# Altium project DCDC_4812.PrjPcb
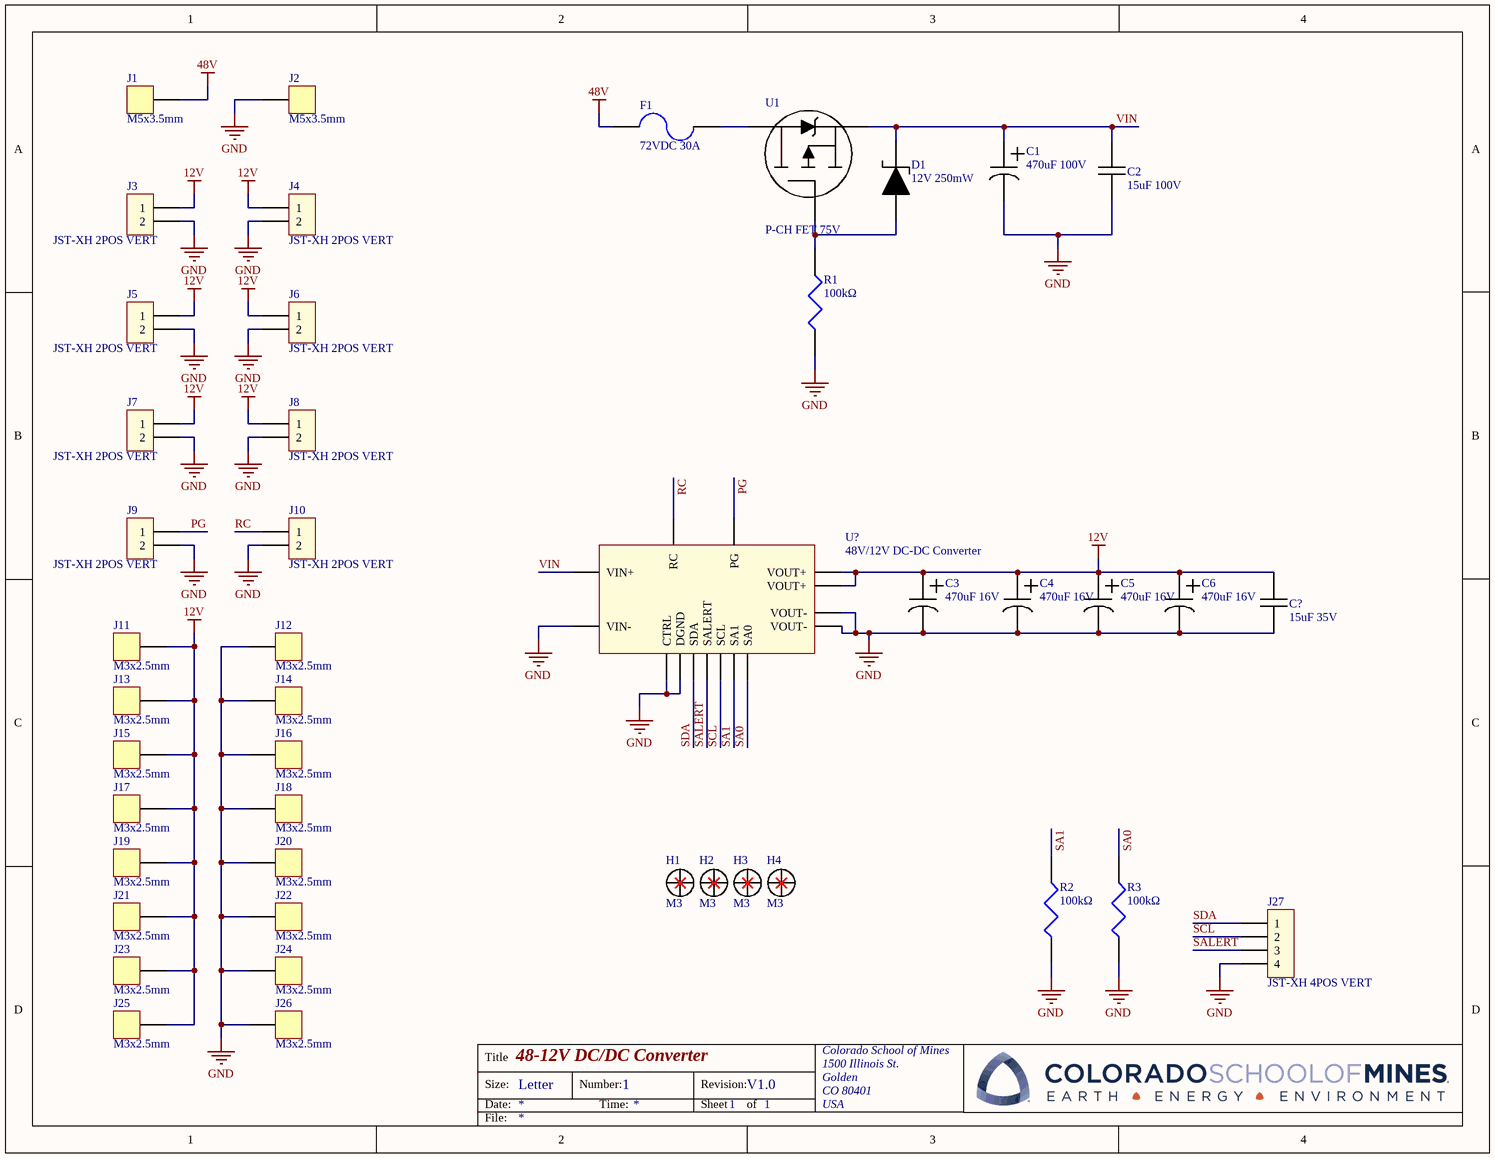
[diagram p0: DCDC_4812.SchDoc]
1 sheet, 45 parts. Net scope: global (net labels, ports and power ports of the same name join across sheets).
Board file: DCDC_4812.PcbDoc

## Sheet DCDC_4812.SchDoc: 48-12V DC/DC Converter
size Letter; Organization: Colorado School of Mines; Address1: 1500 Illinois St.; Address2: Golden; Address3: CO 80401; Address4: USA; DocumentNumber: 1; Revision: V1.0; SheetNumber: 1; SheetTotal: 1

### Parts
C1  470uF 100V  [MAL2150_CASE1821]
C2  15uF 100V  [C2220M Generic]
C3  470uF 16V  [875115357006]
C4  470uF 16V  [875115357006]
C5  470uF 16V  [875115357006]
C6  470uF 16V  [875115357006]
C7  15uF 35V  [C2012M Generic]
D1  12V 250mW  [BZX84-C12,235]
F1  72VDC 30A  [0456030.ER]
H1  M3  [M3_MOUNTING_HOLE]
H2  M3  [M3_MOUNTING_HOLE]
H3  M3  [M3_MOUNTING_HOLE]
H4  M3  [M3_MOUNTING_HOLE]
J1  M5x3.5mm  [74655095]
J2  M5x3.5mm  [74655095]
J3  JST-XH 2POS VERT  [FP-B2B-XH-A_LF_SN-MFG]
J4  JST-XH 2POS VERT  [FP-B2B-XH-A_LF_SN-MFG]
J5  JST-XH 2POS VERT  [FP-B2B-XH-A_LF_SN-MFG]
J6  JST-XH 2POS VERT  [FP-B2B-XH-A_LF_SN-MFG]
J7  JST-XH 2POS VERT  [FP-B2B-XH-A_LF_SN-MFG]
J8  JST-XH 2POS VERT  [FP-B2B-XH-A_LF_SN-MFG]
J9  JST-XH 2POS VERT  [FP-B2B-XH-A_LF_SN-MFG]
J10  JST-XH 2POS VERT  [FP-B2B-XH-A_LF_SN-MFG]
J11  M3x2.5mm  [74650073]
J12  M3x2.5mm  [74650073]
J13  M3x2.5mm  [74650073]
J14  M3x2.5mm  [74650073]
J15  M3x2.5mm  [74650073]
J16  M3x2.5mm  [74650073]
J17  M3x2.5mm  [74650073]
J18  M3x2.5mm  [74650073]
J19  M3x2.5mm  [74650073]
J20  M3x2.5mm  [74650073]
J21  M3x2.5mm  [74650073]
J22  M3x2.5mm  [74650073]
J23  M3x2.5mm  [74650073]
J24  M3x2.5mm  [74650073]
J25  M3x2.5mm  [74650073]
J26  M3x2.5mm  [74650073]
J27  JST-XH 4POS VERT  [JST_B4B-XH-A_LF_SN_0]
R1  100kΩ  [RMCF0805]
R2  100kΩ  [RMCF0805]
R3  100kΩ  [RMCF0805]
U1  P-CH FET 75V  [SMP3003-DL-1E]
U2  48V/12V DC-DC Converter  [BMR4800102/002]

### Nets
12V: C3.1 C4.1 C5.1 C6.1 C7.2 J3.1 J4.1 J5.1 J6.1 J7.1 J8.1 J11.1 J13.1 J15.1 J17.1 J19.1 J21.1 J23.1 J25.1 U2.7(VOUT+) U2.8(VOUT+)
48V: F1.1 J1.1
GND: C1.2 C2.2 C3.2 C4.2 C5.2 C6.2 C7.1 J2.1 J3.2 J4.2 J5.2 J6.2 J7.2 J8.2 J9.2 J10.2 J12.1 J14.1 J16.1 J18.1 J20.1 J22.1 J24.1 J26.1 J27.4 R1.1 R2.1 R3.1 U2.3(VIN-) U2.4(VOUT-) U2.5(VOUT-) U2.9(CTRL) U2.10(DGND)
PG: J9.1 U2.6(PG)
RC: J10.1 U2.2(RC)
SA0: R3.2 U2.15(SA0)
SA1: R2.2 U2.14(SA1)
SALERT: J27.3 U2.12(SALERT)
SCL: J27.2 U2.13(SCL)
SDA: J27.1 U2.11(SDA)
VIN: C1.1 C2.1 D1.3 U1.3 U2.1(VIN+)
NetD1_1: D1.1 R1.2 U1.1
NetF1_2: F1.2 U1.4

Not connected (* = marked no-connect by the designer): H1 1*; H2 1*; H3 1*; H4 1*

### Notes on the sheet
- Title
- Size:
- Date:
- Letter
- Number:
- Time:
- Revision:
- Sheet
- of
- File:

### Library data of the parts
C1 = MAL215099913E3: Vishay CAP ALUM 470UF 20% 100V SMD; Part Number: MAL215099913E3; Manufacturer: Vishay; Value: 470uF 100V; ComponentLink1Description: DigiKey; ComponentLink1URL: https://www.digikey.com/en/products/detail/vishay-beyschlag-draloric-bc-components/MAL215099913E3/5414592
C2 = C5750X7S2A156M250KB: TDK CAP CER 15UF 100V X7S 2220; Manufacturer: TDK Corporation; ComponentLink1Description: DigiKey; ComponentLink1URL: https://www.digikey.com/en/products/detail/tdk-corporation/C5750X7S2A156M250KB/2443522; Part Number: C5750X7S2A156M250KB; Value: 15uF 100V
C3-C6 = 875115357006: Wurth CAP ALUM POLY 470UF 20% 16V SMD; Manufacturer: Würth Elektronik; ComponentLink1Description: DigiKey; ComponentLink1URL: https://www.digikey.com/en/products/detail/w%C3%BCrth-elektronik/875115357006/5147625?s=N4IgTCBcDaIBwHYCsBGFSDMSEAYcDYQBdAXyA; Part Number: CAP ALUM POLY 470UF 20% 16V SMD; Value: 470uF 16V
C7 = C2012X5R1V156M125AC: TDK CAP CER 15UF 35V X5R 0805; Manufacturer: TDK Corporation; Part Number: C2012X5R1V156M125AC; Value: 15uF 35V; ComponentLink1Description: New link; ComponentLink1URL: *
D1 = BZX84-C12,235: Nexperia DIODE ZENER 12V 250MW TO236AB; ComponentLink1Description: DigiKey; ComponentLink1URL: https://www.digikey.com/en/products/detail/nexperia-usa-inc/BZX84-C12-235/5221767; Part Number: BZX84-C12,235; Manufacturer: Nexperia; Value: 12V 250mW
F1 = 0456030.ER: Littelfuse FUSE BOARD MNT 30A 125VAC 72VDC; Manufacturer: Littelfuse; Part Number: 0456030.ER; Value: 72VDC 30A; ComponentLink1Description: DigiKey; ComponentLink1URL: https://www.digikey.com/en/products/detail/littelfuse-inc/0456030-ER/1754635
H1-H4 = M3_Mounting_Hole: MECHANICAL M3 Mounting Hole
J1 J2 = 74655095R: Wurth WP-THRBU REDCUBE THR internal through-hole thread, 10x10mm, M5x3.5mm, 8 pins, 85A; Manufacturer: Wurth Elektronik; Pin Number: 8; Thread: M5; Surface: Tin; Thread Length: 3.5mm; ComponentLink1Description: Manufacturer; ComponentLink1URL: http://www.we-online.de; ComponentLink2Description: Datasheet; ComponentLink2URL: https://katalog.we-online.com/em/datasheet/74655095R.pdf; Operating Temperature: -55 to +150degC; Height: 4mm; Material: Brass; Part Number: 74655095R; Packaging: Tape and Reel; Mounting Technology: SMT; Rated Current: 85A; Publisher: Wurth Elektronik; Published Date: September 2019; Size: 10x10mm; Value: M5x3.5mm
J3-J10 = B2B-XH-A(LF)(SN): JST XH CONN HEADER VERT 2POS 2.5MM; ComponentLink2Description: Datasheet; ComponentLink2URL: http://www.jst-mfg.com/product/pdf/eng/eXH.pdf?5d9b3ba19c79b; Manufacturer: JST; Part Number: B2B-XH-A(LF)(SN); Value: JST-XH 2POS VERT
J11-J26 = 74650073R: Wurth WP-THRBU REDCUBE THR internal through-hole thread, 7x7mm, M3x2.5mm, 4 pins, 50A; Manufacturer: Wurth Elektronik; Pin Number: 4; Thread: M3; Surface: Tin; Thread Length: 2.5mm; ComponentLink1Description: Manufacturer; ComponentLink1URL: http://www.we-online.de; ComponentLink2Description: Datasheet; ComponentLink2URL: https://katalog.we-online.com/em/datasheet/74650073R.pdf; Operating Temperature: -55 to +150degC; Height: 3mm; Material: Brass; Part Number: 74650073R; Packaging: Tape and Reel; Mounting Technology: SMT; Rated Current: 50A; Publisher: Wurth Elektronik; Published Date: September 2019; Size: 7x7mm; Value: M3x2.5mm
J27 = B4B-XH-A(LF)(SN): JST XH CONN HEADER VERT 4POS 2.5MM; ComponentLink2Description: Datasheet; ComponentLink1URL: https://upverter.com/upn/revision/ec0bbf06de5e0de7/; ComponentLink1Description: Upverter; ComponentLink2URL: http://www.jst-mfg.com/product/pdf/eng/eXH.pdf; Part Number: B4B-XH-A(LF)(SN); Manufacturer: JST; Value: JST-XH 4POS VERT
R1-R3 = RMCF0805FT100K: Stackpole RES 100K OHM 1% 1/8W 0805; Manufacturer: Stackpole Electronics Inc; Part Number: RMCF0805FT100K; Value: 100kΩ
U1 = SMP3003-DL-1E: ON Semi MOSFET P-CH 75V 100A D2PAK; Manufacturer: ON Semiconductor; Part Number: SMP3003-DL-1E; Value: P-CH FET 75V; ComponentLink1Description: DigiKey; ComponentLink1URL: https://www.digikey.com/en/products/detail/on-semiconductor/SMP3003-DL-1E/4849083
U2 = BMR4800102/002: Flex Power DC DC CONVERTER 12V 900W; Manufacturer: Flex Power Modules; Part Number: BMR4800102/002; Value: 48V/12V DC-DC Converter; ComponentLink1Description: DigiKey; ComponentLink1URL: https://www.digikey.com/en/products/detail/flex-power-modules/BMR4800102-002/10287640?s=N4IgjCBcoExgHAdiqAxlAZgQwDYGcBTAGhAHsoBtEATgAZaB1EAXRIAcAXKEAVQDsAlhwDyGALIEseAK4AnAiAC%2ByoA